# EAGLE design zxld383-boost-driver-12mm-mk-2 (EAGLE 6.4)
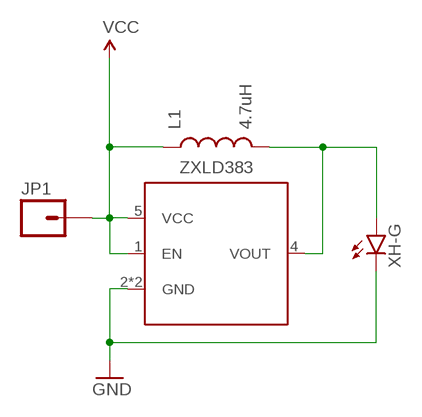
[diagram p0: schematic, sheet 1]

## Parts
JP1  M01NOT-A-VIA-NOPE  [1X01_NOSILK_NOSTOP]
L1  4.7uH  INDUCTOR1007  [1007]
XH-G  LEDXH-G  [CREE-XLAMP-XH-G]
ZXLD383  ZXLD383  [TSOT-23-5]

## Nets
GND: XH-G.K(C) ZXLD383.2(GND) ZXLD383.3(GND)
VCC: JP1.P$1 L1.1 ZXLD383.1(EN) ZXLD383.5(VCC)
VOUT: L1.2 XH-G.A ZXLD383.4(VOUT)

## Library data of the parts
JP1 = A_butts:M01: Header 1 Standard 1-pin 0.1" header. Use with straight break away headers (SKU : PRT-00116), right angle break away headers (PRT-00553), swiss pins (PRT-00743), machine pins (PRT-00117), and female headers (PRT-00115).
L1 = A_butts:INDUCTOR: Inductors Basic Inductor/Choke - 0603 and 1206. Footprints are not proven and vary greatly between part numbers. SRN6045- 33uH, 20% 1.4A SDR0403-560KL - 56uH, 10%, 500mA RMS/740mA peak
XH-G = A_butts:LED: LEDs Standard schematic elements and footprints for 5mm, 3mm, 1206, and 0603 sized LEDs. 5mm - Spark Fun Electronics SKU : COM-00529 (and others)
ZXLD383 = A_butts:ZXLD383

## Board
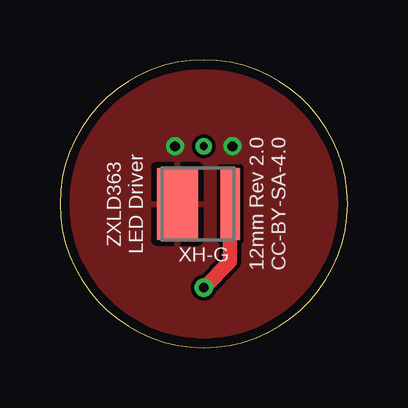
[diagram p1: board, top side]
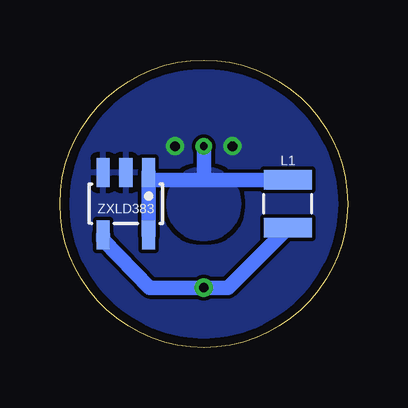
[diagram p2: board, bottom side, seen from below]

Size 12 x 12 mm. Coordinates in mm from the lower left corner, seen from the top.
Outline: 0,6 arc90 6,0 arc90 12,6 arc90 6,12 arc90 0,6
Copper layers (1*16): Top 0.0356mm / dielectric 1.5011mm / Bottom 0.0356mm
Design rules "LaenPCBOrder2": minimum track width 6mil, minimum drill 13mil, track to track 6mil, track to pad 6mil, pad to pad 6mil, via to via 6mil, smd to smd 6mil, copper to edge 15mil, drill to drill 6mil, minimum pad ring 7mil, minimum via ring 7mil, stop-mask expansion 3mil, vias tented up to drill 20mil, thermal gap 10mil

### Footprints (pad centres in the part's own frame; a part is rotated, then mirrored left to right if it is on the bottom)
1X01_NOSILK_NOSTOP = drill 0.33: P$1 0,0
1007 = smd 2 x 0.8: 1 0,1; 2 0,-1
CREE-XLAMP-XH-G = smd 0.8 x 3: A 1.1,0 | smd 1.7 x 3: K -1.1,0
TSOT-23-5 = smd 1.2 x 0.55: 1 -1.3,0.95; 2 -1.3,0; 3 -1.3,-0.95; 4 1.3,-0.95; 5 1.3,0.95

### Placement (x,y rotation side)
JP1  6,8.4 0 top
L1  2.5,6 0 bottom
XH-G  6,6 0 top
ZXLD383  9.25,6 270 bottom

### Tracks (layer width: path | path; a pad name or v marks a point on that pad's centre or on a via)
GND  (via drill 0.4)
  other vias: 4.8,8.4 7.2,8.4
  pour Top (rank 6): 6,0 arc-90 0,6 arc-90 6,12 arc-90 12,6 arc-90
  pour Bottom (rank 6): 6,0 arc-90 0,6 arc-90 6,12 arc-90 12,6 arc-90
VCC
  Bottom 0.61: 6,7 L1.1 | JP1.P$1 6,7 | ZXLD383.1 8.3,7 | 8.3,7 ZXLD383.5 | 6,7 8.3,7
  pour Bottom: 4.5,6 arc90 6,4.5 arc90 7.5,6 arc90 6,7.5 arc90
VOUT  (via drill 0.4)
  Top 0.61: XH-G.A 7.1,3.6 v6,2.5
  Bottom 0.61: L1.2 5,2.5 v6,2.5 8.25,2.5 10.2,4.5 ZXLD383.4

### Text on the board
tPlace: ZXLD363 / LED Driver | 12mm Rev 2.0 / CC-BY-SA-4.0